# Altium schematic sheet MC.SchDoc
size Tabloid; Date: Date; Author: Author 1; Revision: 1; Size: 11x17; Sheet_Name: Sheet Description
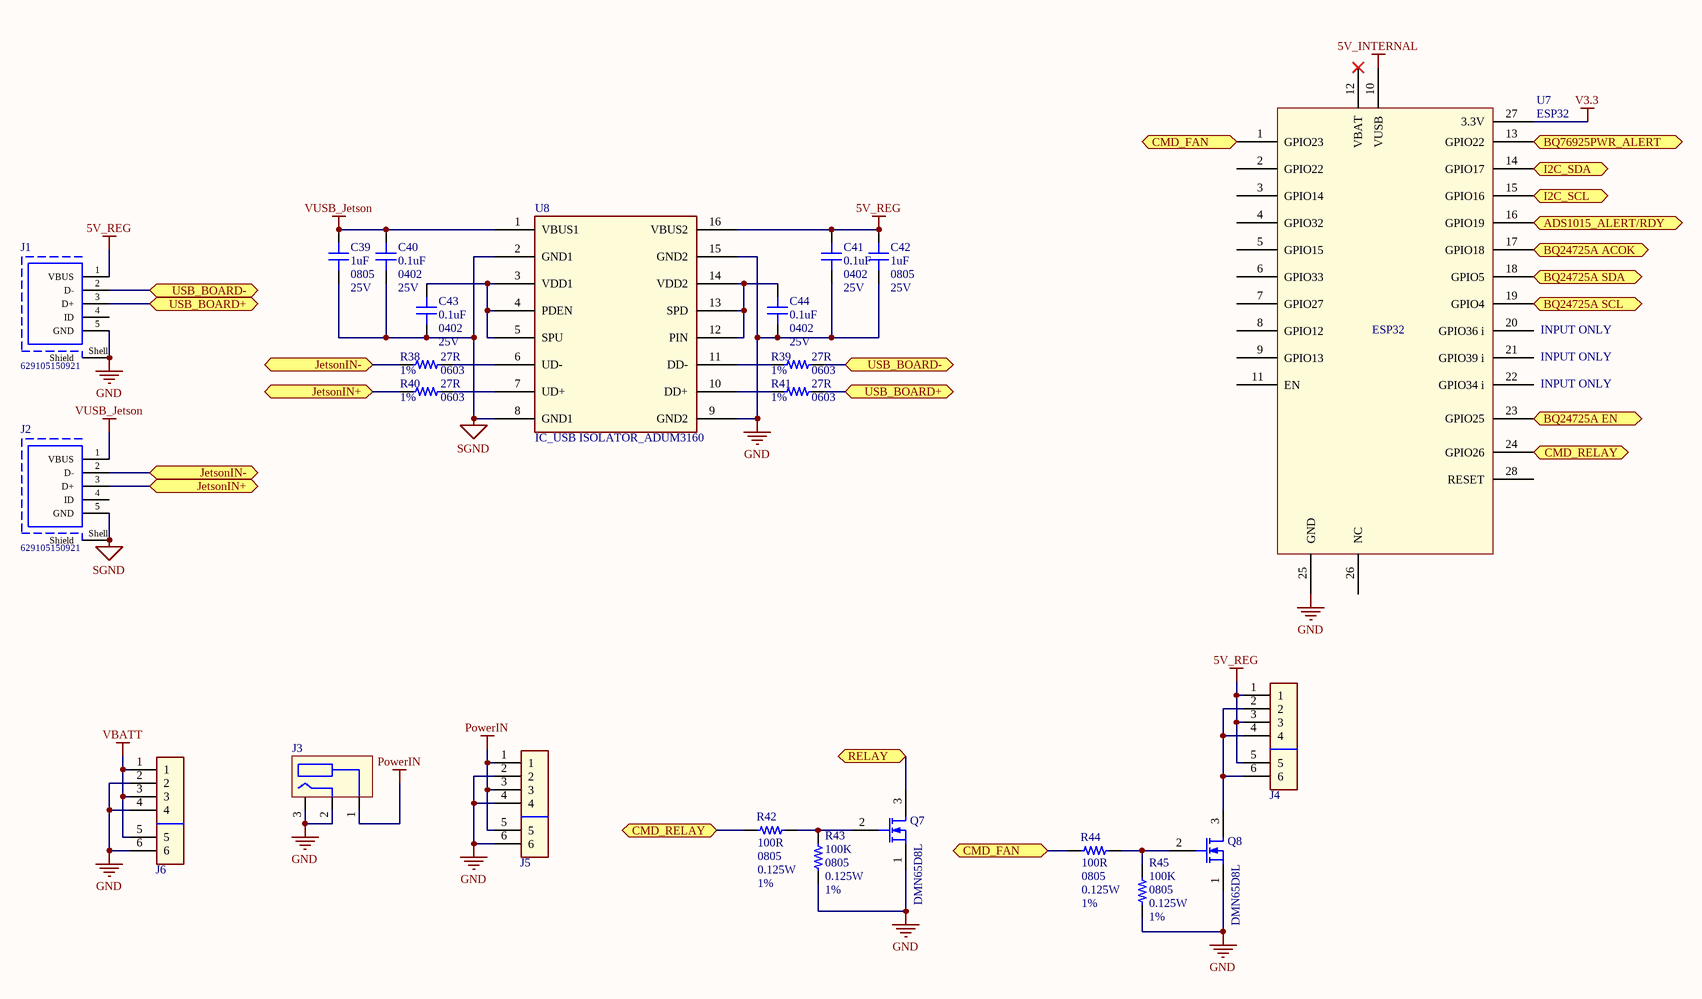
[diagram p0: MC.SchDoc]

## Parts
C39  value 1uF  Package: 0805  Voltage: 25V  [CAP_0805]  (hidden comment: CAP_‎‎‎‎CL21B105KAFNNNE‎)
C40  value 0.1uF  Package: 0402  Voltage: 25V  [CAP_0402]  (hidden comment: CAP_‎‎CL05A104KA5NNNC‎)
C41  value 0.1uF  Package: 0402  Voltage: 25V  [CAP_0402]  (hidden comment: CAP_‎‎CL05A104KA5NNNC‎)
C42  value 1uF  Package: 0805  Voltage: 25V  [CAP_0805]  (hidden comment: CAP_‎‎‎‎CL21B105KAFNNNE‎)
C43  value 0.1uF  Package: 0402  Voltage: 25V  [CAP_0402]  (hidden comment: CAP_‎‎CL05A104KA5NNNC‎)
C44  value 0.1uF  Package: 0402  Voltage: 25V  [CAP_0402]  (hidden comment: CAP_‎‎CL05A104KA5NNNC‎)
J1  629105150921  [629105150921]
J2  629105150921  [629105150921]
J3  Barrel 5.5x2.5mm  [Barrel 5.5mm 2.5mm]  (value not drawn)
J4  MOLEX 4 POS - TERMINAL BLOCK 2 POS  [MOLEX4POS_TERMBLOCK2POS]  (value not drawn)
J5  MOLEX 4 POS - TERMINAL BLOCK 2 POS  [MOLEX4POS_TERMBLOCK2POS]  (value not drawn)
J6  MOLEX 4 POS - TERMINAL BLOCK 2 POS  [MOLEX4POS_TERMBLOCK2POS]  (value not drawn)
Q7  Part number: DMN65D8L  [SOT-23]  (hidden comment: NMOS_DMN65D8L)
Q8  Part number: DMN65D8L  [SOT-23]  (hidden comment: NMOS_DMN65D8L)
R38  value 27R  Package: 0603  Tolerance: 1%  [RES_0603]  (hidden comment: RES_‎‎‎‎‎RMCF0603FT27R0‎)
R39  value 27R  Package: 0603  Tolerance: 1%  [RES_0603]  (hidden comment: RES_‎‎‎‎‎RMCF0603FT27R0‎)
R40  value 27R  Package: 0603  Tolerance: 1%  [RES_0603]  (hidden comment: RES_‎‎‎‎‎RMCF0603FT27R0‎)
R41  value 27R  Package: 0603  Tolerance: 1%  [RES_0603]  (hidden comment: RES_‎‎‎‎‎RMCF0603FT27R0‎)
R42  value 100R  Package: 0805  Power: 0.125W  Tolerance: 1%  [RES_0805]  (hidden comment: RES_‎‎‎ERA-6AEB101V‎)
R43  value 100K  Package: 0805  Power: 0.125W  Tolerance: 1%  [RES_0805]  (hidden comment: RES_‎RMCF0805FT100K‎)
R44  value 100R  Package: 0805  Power: 0.125W  Tolerance: 1%  [RES_0805]  (hidden comment: RES_‎‎‎ERA-6AEB101V‎)
R45  value 100K  Package: 0805  Power: 0.125W  Tolerance: 1%  [RES_0805]  (hidden comment: RES_‎RMCF0805FT100K‎)
U7  ESP32  [ESP32 V1]
U8  IC_USB ISOLATOR_ADUM3160  [SOIC16]

## Ports
ADS1015_ALERT/RDY, BQ24725A ACOK, BQ24725A EN, BQ24725A SCL, BQ24725A SDA, BQ76925PWR_ALERT, CMD_FAN, CMD_RELAY, I2C_SCL, I2C_SDA, JetsonIN+, JetsonIN-, RELAY, USB_BOARD+, USB_BOARD-

## Nets
5V_INTERNAL: U7.10(VUSB)
5V_REG: C41.1 C42.1 J1.1(VBUS) J4.1 J4.3 J4.5 U8.16(VBUS2)
GND: C41.2 C42.2 C44.2 J1.5(GND) J1.Shell(Shield) J3.2 J3.3 J5.2 J5.4 J5.6 J6.2 J6.4 J6.6 Q7.1(S) Q8.1(S) R43.2 R45.2 U7.25(GND) U8.9(GND2) U8.15(GND2)
PowerIN: J3.1 J5.1 J5.3 J5.5
SGND: C39.2 C40.2 C43.2 J2.5(GND) J2.Shell(Shield) U8.2(GND1) U8.8(GND1)
V3.3: U7.27(3.3V)
VBATT: J6.1 J6.3 J6.5
VUSB_Jetson: C39.1 C40.1 J2.1(VBUS) U8.1(VBUS1)
ADS1015_ALERT/RDY: U7.16(GPIO19) ; port ADS1015_ALERT/RDY
BQ24725A ACOK: U7.17(GPIO18) ; port BQ24725A ACOK
BQ24725A EN: U7.23(GPIO25) ; port BQ24725A EN
BQ24725A SCL: U7.19(GPIO4) ; port BQ24725A SCL
BQ24725A SDA: U7.18(GPIO5) ; port BQ24725A SDA
BQ76925PWR_ALERT: U7.13(GPIO22) ; port BQ76925PWR_ALERT
CMD_FAN: R44.2 U7.1(GPIO23) ; port CMD_FAN
CMD_RELAY: R42.2 U7.24(GPIO26) ; port CMD_RELAY
I2C_SCL: U7.15(GPIO16) ; port I2C_SCL
I2C_SDA: U7.14(GPIO17) ; port I2C_SDA
JetsonIN+: J2.3(D+) R40.1 ; port JetsonIN+
JetsonIN-: J2.2(D-) R38.1 ; port JetsonIN-
RELAY: Q7.3(D) ; port RELAY
USB_BOARD+: J1.3(D+) R41.2 ; port USB_BOARD+
USB_BOARD-: J1.2(D-) R39.2 ; port USB_BOARD-
NetC43_1: C43.1 U8.3(VDD1) U8.4(PDEN) U8.5(SPU)
NetC44_1: C44.1 U8.12(PIN) U8.13(SPD) U8.14(VDD2)
NetJ4_2: J4.2 J4.4 J4.6 Q8.3(D)
NetQ7_2: Q7.2(G) R42.1 R43.1
NetQ8_2: Q8.2(G) R44.1 R45.1
NetR38_2: R38.2 U8.6(UD-)
NetR39_1: R39.1 U8.11(DD-)
NetR40_2: R40.2 U8.7(UD+)
NetR41_1: R41.1 U8.10(DD+)

Not connected (* = marked no-connect by the designer): J1 4(ID); J2 4(ID); U7 2(GPIO22) 3(GPIO14) 4(GPIO32) 5(GPIO15) 6(GPIO33) 7(GPIO27) 8(GPIO12) 9(GPIO13) 11(EN) 12(VBAT)* 20(GPIO36_i) 21(GPIO39_i) 22(GPIO34_i) 26(NC) 28(RESET)

## Notes on the sheet
- (near U7) INPUT ONLY
- Sheet Name
- Project Title
- Global Project
- Size
- Group
- Revision
- Date
- Sheet
- of
- Filename
- Designers

## Library data of the parts
C39 C42 = CAP_‎‎‎‎CL21B105KAFNNNE‎: CAP CER 1uF 25V 0805; Part number: CL21B105KAFNNNE‎
C40 C41 C43 C44 = CAP_‎‎CL05A104KA5NNNC‎: CAP CER 0.1uF 25V 0402; Part number: CL05A104KA5NNNC‎
J1 J2 = 629105150921: Micro USB 2.0 Type AB Receptacle WR-COM, Horizontal, SMT; Rated Current: 1.8 A; Contact Resistance: 30 mOhm; Working Voltage: 30 VAC; ComponentLink1Description: Manufacturer; ComponentLink1URL: http://www.we-online.de; ComponentLink2Description: Datasheet; ComponentLink2URL: https://katalog.we-online.de/em/datasheet/629105150921.pdf; Part Number: 629105150921; Published Date: September 2018; Publisher: Wurth Elektronik; Orientation: Horizontal; Connector Type: Micro USB 2.0 Type AB; Operating Temperature: -40 to 85 degC; Mounting Technology: SMT; Gender: Receptacle; Packaging: Tape and Reel
J3 = Barrel 5.5x2.5mm: Jack 5.5x2.5mm; Part number: *
Q7 Q8 = NMOS_DMN65D8L: NMOS_N-Channel 60V 310mA (Ta) 370mW (Ta); Vgs: 20V; Package: SOT-23; Id: 310mA; Vdss: 60V
R38-R41 = RES_‎‎‎‎‎RMCF0603FT27R0‎: RES 27R 1% 1/10W 0603; Power: 0.1W; Part number: RMCF0603FT27R0‎
R42 R44 = RES_‎‎‎ERA-6AEB101V‎: RES 100R 1% 1/8W 0805; Part number: ‎ERA-6AEB101V‎
R43 R45 = RES_‎RMCF0805FT100K‎: RES 100K 1% 1/8W 0805; Part number: ‎RMCF0805FT100K‎
U8 = IC_USB ISOLATOR_ADUM3160: USB Isolator; Part number: ADUM3160
J4-J6 = MOLEX 4 POS - TERMINAL BLOCK 2 POS: Part number: *